# Altium project Luna v2.PrjPcb (part 2 of 7)

## Sheet 05 MIMXRT1170 PART1.SchDoc: Luna v2
size A2; VersionControl_RevNumber: DNP; IsUserConfigurable: DNP; OrgAddr3: Sunrise FL 33323; OrgName: Pixels on Target; Page Create Date: March  8, 1995; Page Number: 5; Page Size: A2; Page Count: 14; OrgAddr2: Suite #104; RevCode: A; Doc: SCH30-00070-00; DsnPath: C:\Users\Carter Nichols\Documents\BitBucket boards (Cadence)\30-00070-00_Original\SCH30-00070-00.DSN; SchematicName: SC30-00070-00; PageName: 05-POWER IN; PageSize: A2; TopSchematic: True; Address4: United States
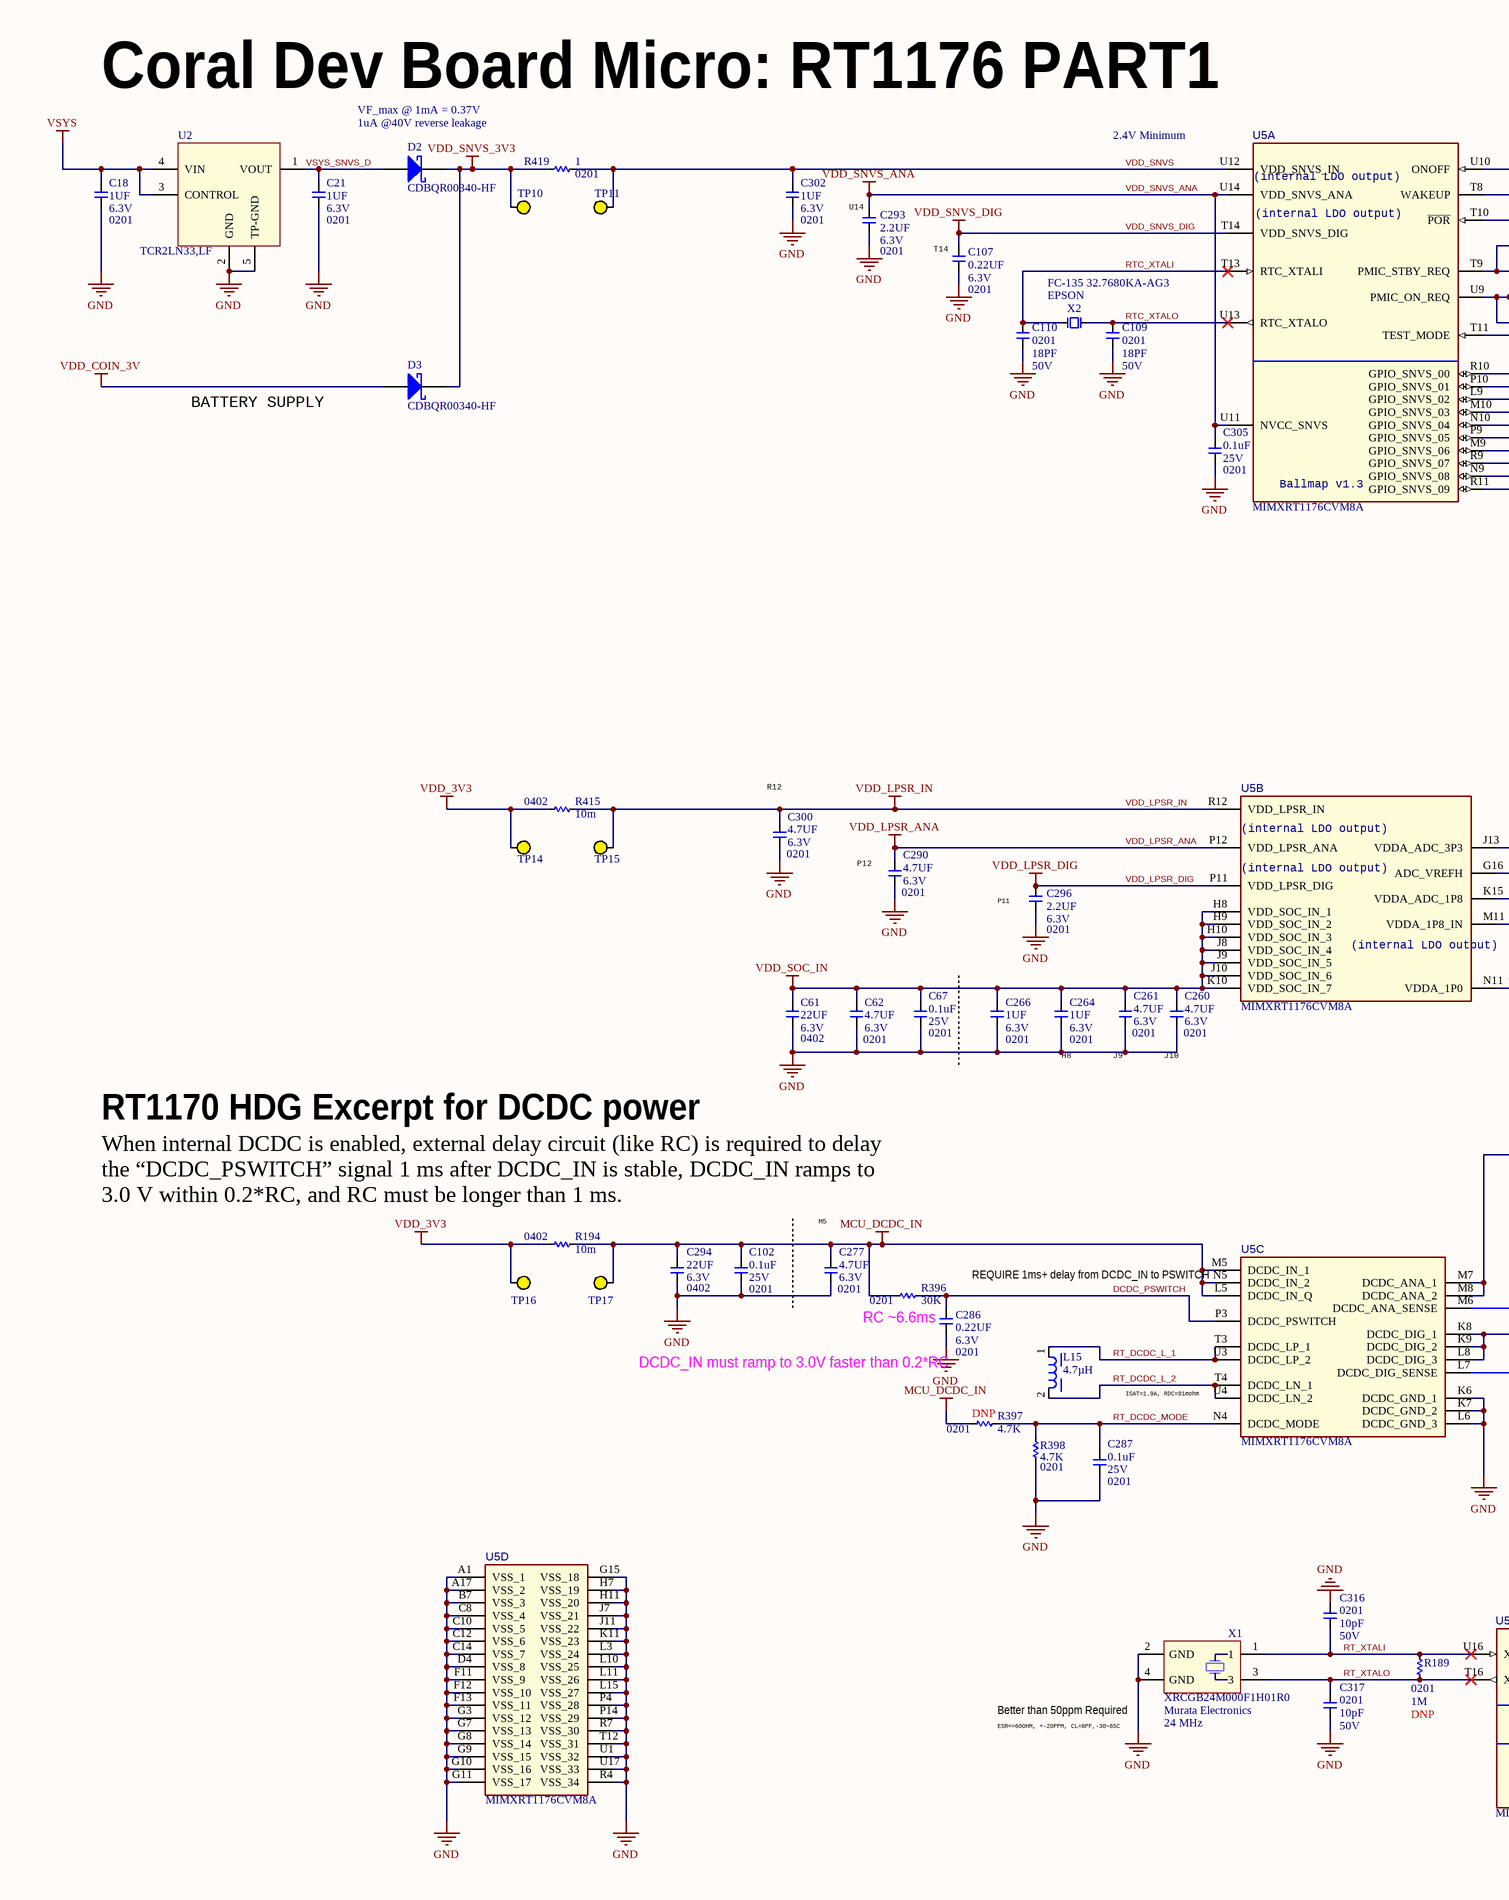
[diagram p7: 05 MIMXRT1170 PART1.SchDoc, left]
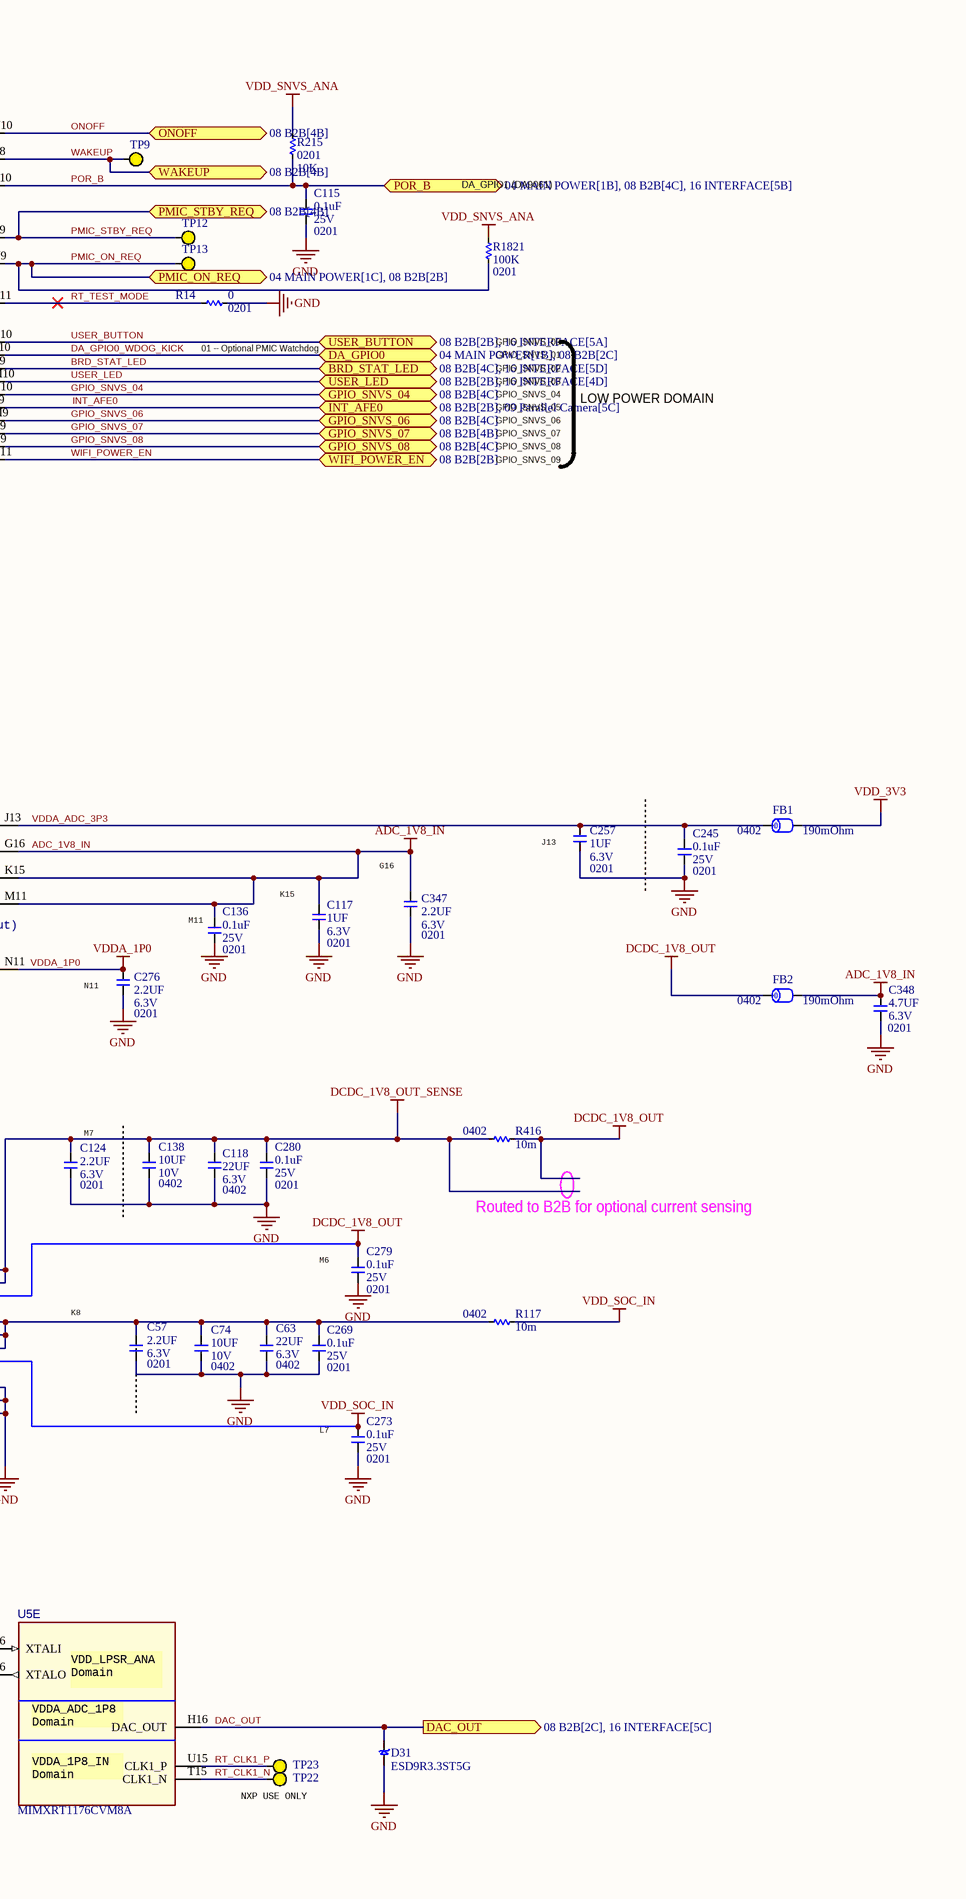
[diagram p8: 05 MIMXRT1170 PART1.SchDoc, right]

### Parts
C18  value 1UF  Package: 0201  Voltage: 6.3V  [C0201_H0.39MM]  (hidden comment: __Template_Cap)
C21  value 1UF  Package: 0201  Voltage: 6.3V  [C0201_H0.39MM]  (hidden comment: __Template_Cap)
C57  value 2.2UF  Package: 0201  Voltage: 6.3V  [C0201_H0.39MM]  (hidden comment: __Template_Cap)
C61  value 22UF  Package: 0402  Voltage: 6.3V  [C0402]  (hidden comment: __Template_Cap)
C62  value 4.7UF  Package: 0201  Voltage: 6.3V  [C0201Y]  (hidden comment: __Template_Cap)
C63  value 22UF  Package: 0402  Voltage: 6.3V  [C0402]  (hidden comment: __Template_Cap)
C67  value 0.1uF  Package: 0201  Voltage: 25V  [C0201Y]  (hidden comment: __Template_Cap)
C74  value 10UF  Package: 0402  Voltage: 10V  [C0402]  (hidden comment: __Template_Cap)
C102  value 0.1uF  Package: 0201  Voltage: 25V  [C0201Y]  (hidden comment: __Template_Cap)
C107  value 0.22UF  Package: 0201  Voltage: 6.3V  [C0201]  (hidden comment: __Template_Cap)
C109  value 18PF  Package: 0201  Voltage: 50V  [C0201Y]  (hidden comment: __Template_Cap)
C110  value 18PF  Package: 0201  Voltage: 50V  [C0201Y]  (hidden comment: __Template_Cap)
C115  value 0.1uF  Package: 0201  Voltage: 25V  [C0201Y]  (hidden comment: __Template_Cap)
C117  value 1UF  Package: 0201  Voltage: 6.3V  [C0201_H0.39MM]  (hidden comment: __Template_Cap)
C118  value 22UF  Package: 0402  Voltage: 6.3V  [C0402]  (hidden comment: __Template_Cap)
C124  value 2.2UF  Package: 0201  Voltage: 6.3V  [C0201_H0.39MM]  (hidden comment: __Template_Cap)
C136  value 0.1uF  Package: 0201  Voltage: 25V  [C0201Y]  (hidden comment: __Template_Cap)
C138  value 10UF  Package: 0402  Voltage: 10V  [C0402]  (hidden comment: __Template_Cap)
C245  value 0.1uF  Package: 0201  Voltage: 25V  [C0201Y]  (hidden comment: __Template_Cap)
C257  value 1UF  Package: 0201  Voltage: 6.3V  [C0201_H0.39MM]  (hidden comment: __Template_Cap)
C260  value 4.7UF  Package: 0201  Voltage: 6.3V  [C0201Y]  (hidden comment: __Template_Cap)
C261  value 4.7UF  Package: 0201  Voltage: 6.3V  [C0201Y]  (hidden comment: __Template_Cap)
C264  value 1UF  Package: 0201  Voltage: 6.3V  [C0201_H0.39MM]  (hidden comment: __Template_Cap)
C266  value 1UF  Package: 0201  Voltage: 6.3V  [C0201_H0.39MM]  (hidden comment: __Template_Cap)
C269  value 0.1uF  Package: 0201  Voltage: 25V  [C0201Y]  (hidden comment: __Template_Cap)
C273  value 0.1uF  Package: 0201  Voltage: 25V  [C0201Y]  (hidden comment: __Template_Cap)
C276  value 2.2UF  Package: 0201  Voltage: 6.3V  [C0201_H0.39MM]  (hidden comment: __Template_Cap)
C277  value 4.7UF  Package: 0201  Voltage: 6.3V  [C0201Y]  (hidden comment: __Template_Cap)
C279  value 0.1uF  Package: 0201  Voltage: 25V  [C0201Y]  (hidden comment: __Template_Cap)
C280  value 0.1uF  Package: 0201  Voltage: 25V  [C0201Y]  (hidden comment: __Template_Cap)
C286  value 0.22UF  Package: 0201  Voltage: 6.3V  [C0201]  (hidden comment: __Template_Cap)
C287  value 0.1uF  Package: 0201  Voltage: 25V  [C0201Y]  (hidden comment: __Template_Cap)
C290  value 4.7UF  Package: 0201  Voltage: 6.3V  [C0201Y]  (hidden comment: __Template_Cap)
C293  value 2.2UF  Package: 0201  Voltage: 6.3V  [C0201_H0.39MM]  (hidden comment: __Template_Cap)
C294  value 22UF  Package: 0402  Voltage: 6.3V  [C0402]  (hidden comment: __Template_Cap)
C296  value 2.2UF  Package: 0201  Voltage: 6.3V  [C0201_H0.39MM]  (hidden comment: __Template_Cap)
C300  value 4.7UF  Package: 0201  Voltage: 6.3V  [C0201Y]  (hidden comment: __Template_Cap)
C302  value 1UF  Package: 0201  Voltage: 6.3V  [C0201_H0.39MM]  (hidden comment: __Template_Cap)
C305  value 0.1uF  Package: 0201  Voltage: 25V  [C0201Y]  (hidden comment: __Template_Cap)
C316  value 10pF  Package: 0201  Voltage: 50V  [C0201Y]  (hidden comment: __Template_Cap)
C317  value 10pF  Package: 0201  Voltage: 50V  [C0201Y]  (hidden comment: __Template_Cap)
C347  value 2.2UF  Package: 0201  Voltage: 6.3V  [C0201_H0.39MM]  (hidden comment: __Template_Cap)
C348  value 4.7UF  Package: 0201  Voltage: 6.3V  [C0201Y]  (hidden comment: __Template_Cap)
D2  value CDBQR00340-HF  [D0402_H0.55MM]  (hidden comment: __Template_DIODE_SCHOTTKY)
D3  value CDBQR00340-HF  [D0402_H0.55MM]  (hidden comment: __Template_DIODE_SCHOTTKY)
D31  value ESD9R3.3ST5G  [SOD1060X40]  (hidden comment: __Template_Diode_TVS_A/K)
FB1  Package: 0402  Rdc max: 190mOhm  [L0402_H0.55MM]  (hidden comment: __Template_Ferrite_Bead)
FB2  Package: 0402  Rdc max: 190mOhm  [L0402_H0.55MM]  (hidden comment: __Template_Ferrite_Bead)
L15  value 4.7µH  [IND_74404041047]  (hidden comment: IND_74404041047)
R14  value 0  Package: 0201  [R0201]
R117  value 10m  Package: 0402  [R0402]
R189  value 1M  Package: 0201  [R0201]
R194  value 10m  Package: 0402  [R0402]
R215  value 10K  Package: 0201  [R0201]
R396  value 30K  Package: 0201  [R0201]
R397  value 4.7K  Package: 0201  [R0201]
R398  value 4.7K  Package: 0201  [R0201]
R415  value 10m  Package: 0402  [R0402]
R416  value 10m  Package: 0402  [R0402]
R419  value 1  Package: 0201  [R0201]
R1821  value 100K  Package: 0201  [R0201]
TP9  TESTPAD_30MIL  [TESTPAD_SMT_30MIL]  (value not drawn)  (no BOM)
TP10  TESTPAD_30MIL  [TESTPAD_SMT_30MIL]  (value not drawn)  (no BOM)
TP11  TESTPAD_30MIL  [TESTPAD_SMT_30MIL]  (value not drawn)  (no BOM)
TP12  TESTPAD_30MIL  [TESTPAD_SMT_30MIL]  (value not drawn)  (no BOM)
TP13  TESTPAD_30MIL  [TESTPAD_SMT_30MIL]  (value not drawn)  (no BOM)
TP14  TESTPAD_30MIL  [TESTPAD_SMT_30MIL]  (value not drawn)  (no BOM)
TP15  TESTPAD_30MIL  [TESTPAD_SMT_30MIL]  (value not drawn)  (no BOM)
TP16  TESTPAD_30MIL  [TESTPAD_SMT_30MIL]  (value not drawn)  (no BOM)
TP17  TESTPAD_30MIL  [TESTPAD_SMT_30MIL]  (value not drawn)  (no BOM)
TP22  TESTPAD_30MIL  [TESTPAD_SMT_30MIL]  (value not drawn)  (no BOM)
TP23  TESTPAD_30MIL  [TESTPAD_SMT_30MIL]  (value not drawn)  (no BOM)
U2  MFG P/N: TCR2LN33,LF  [SDFN80X80X40-5]  (hidden comment: REG_LIN_TCR2LN33)
U5  MFG P/N: MIMXRT1176CVM8A  [BGA289C80P17X17_1400X14000X152]  (hidden comment: MCU_MIMXRT1176CVM8A)  (parts A,B,C,D,E of 12)
X1  Mfg: XRCGB24M000F1H01R0  Mfg P/N: Murata Electronics  Frequency: 24 MHz  [XTAL_MURATA_XRCGB24M000F1H01R0]  (hidden comment: XTAL_MURATA_XRCGB24M000F1H01R0)
X2  Mfg: FC-135 32.7680KA-AG3  Mfg P/N: EPSON  [XTAL_EPSON_ADUCM355BCCZ]  (hidden comment: __template_xtal)

### Ports
BRD_STAT_LED (bidir, see 08 B2B[4C], 16 INTERFACE[5D]), DA_GPIO0 (bidir, see 04 MAIN POWER[1B], 08 B2B[2C]), DAC_OUT (out, see 08 B2B[2C], 16 INTERFACE[5C]), GPIO_SNVS_04 (bidir, see 08 B2B[4C]), GPIO_SNVS_06 (bidir, see 08 B2B[4C]), GPIO_SNVS_07 (bidir, see 08 B2B[4B]), GPIO_SNVS_08 (bidir, see 08 B2B[4C]), INT_AFE0 (bidir, see 08 B2B[2B], 09 Parallel Camera[5C]), ONOFF (bidir, see 08 B2B[4B]), PMIC_ON_REQ (bidir, see 04 MAIN POWER[1C], 08 B2B[2B]), PMIC_STBY_REQ (bidir, see 08 B2B[4B]), POR_B (bidir, see 04 MAIN POWER[1B], 08 B2B[4C], 16 INTERFACE[5B]), USER_BUTTON (bidir, see 08 B2B[2B], 16 INTERFACE[5A]), USER_LED (bidir, see 08 B2B[2B], 16 INTERFACE[4D]), WAKEUP (bidir, see 08 B2B[4B]), WIFI_POWER_EN (bidir, see 08 B2B[2B])

### Nets
ADC_1V8_IN: C117.1 C136.1 C347.1 C348.1 FB2.2 U5.G16(ADC_VREFH) U5.K15(VDDA_ADC_1P8) U5.M11(VDDA_1P8_IN)
DCDC_1V8_OUT: C279.1 FB2.1 R416.2 U5.M6(DCDC_ANA_SENSE)
DCDC_1V8_OUT_SENSE: C118.1 C124.1 C138.1 C280.1 R416.1 U5.M7(DCDC_ANA_1) U5.M8(DCDC_ANA_2)
GND: C18.2 C21.2 C57.2 C61.2 C62.2 C63.2 C67.2 C74.2 C102.2 C107.2 C109.2 C110.2 C115.2 C117.2 C118.2 C124.2 C136.2 C138.2 C245.2 C257.2 C260.2 C261.2 C264.2 C266.2 C269.2 C273.2 C276.2 C277.2 C279.2 C280.2 C286.2 C287.2 C290.2 C293.2 C294.2 C296.2 C300.2 C302.2 C305.2 C316.1 C317.2 C347.2 C348.2 D31.A R14.2 R398.1 U2.2(GND) U2.5(TP-GND) U5.A1(VSS_1) U5.A17(VSS_2) U5.B7(VSS_3) U5.C8(VSS_4) U5.C10(VSS_5) U5.C12(VSS_6) U5.C14(VSS_7) U5.D4(VSS_8) U5.F11(VSS_9) U5.F12(VSS_10) U5.F13(VSS_11) U5.G3(VSS_12) U5.G7(VSS_13) U5.G8(VSS_14) U5.G9(VSS_15) U5.G10(VSS_16) U5.G11(VSS_17) U5.G15(VSS_18) U5.H7(VSS_19) U5.H11(VSS_20) U5.J7(VSS_21) U5.J11(VSS_22) U5.K6(DCDC_GND_1) U5.K7(DCDC_GND_2) U5.K11(VSS_23) U5.L3(VSS_24) U5.L6(DCDC_GND_3) U5.L10(VSS_25) U5.L11(VSS_26) U5.L15(VSS_27) U5.P4(VSS_28) U5.P14(VSS_29) U5.R4(VSS_34) U5.R7(VSS_30) U5.T12(VSS_31) U5.U1(VSS_32) U5.U17(VSS_33) X1.2(GND) X1.4(GND)
MCU_DCDC_IN: C102.1 C277.1 C294.1 R194.2 R396.1 R397.1 TP17.1 U5.L5(DCDC_IN_Q) U5.M5(DCDC_IN_1) U5.N5(DCDC_IN_2)
VDD_3V3: FB1.2 R194.1 R415.1 TP14.1 TP16.1
VDD_COIN_3V: D3.A
VDD_LPSR_ANA: C290.1 U5.P12(VDD_LPSR_ANA)
VDD_LPSR_DIG: C296.1 U5.P11(VDD_LPSR_DIG)
VDD_LPSR_IN: C300.1 R415.2 TP15.1 U5.R12(VDD_LPSR_IN)
VDD_SNVS_3V3: D2.K D3.K R419.1 TP10.1
VDD_SNVS_ANA: C293.1 C305.1 R215.2 R1821.2 U5.U11(NVCC_SNVS) U5.U14(VDD_SNVS_ANA)
VDD_SNVS_DIG: C107.1 U5.T14(VDD_SNVS_DIG)
VDD_SOC_IN: C61.1 C62.1 C67.1 C260.1 C261.1 C264.1 C266.1 C273.1 R117.2 U5.H8(VDD_SOC_IN_1) U5.H9(VDD_SOC_IN_2) U5.H10(VDD_SOC_IN_3) U5.J8(VDD_SOC_IN_4) U5.J9(VDD_SOC_IN_5) U5.J10(VDD_SOC_IN_6) U5.K10(VDD_SOC_IN_7) U5.L7(DCDC_DIG_SENSE)
VDDA_1P0: C276.1 U5.N11(VDDA_1P0)
VSYS: C18.1 U2.3(CONTROL) U2.4(VIN)
BRD_STAT_LED: U5.L9(GPIO_SNVS_02) ; port BRD_STAT_LED
DA_GPIO0_WDOG_KICK: U5.P10(GPIO_SNVS_01) ; port DA_GPIO0
DAC_OUT: D31.K U5.H16(DAC_OUT) ; port DAC_OUT
DCDC_PSWITCH: C286.1 R396.2 U5.P3(DCDC_PSWITCH)
GPIO_SNVS_04: U5.N10(GPIO_SNVS_04) ; port GPIO_SNVS_04
GPIO_SNVS_06: U5.M9(GPIO_SNVS_06) ; port GPIO_SNVS_06
GPIO_SNVS_07: U5.R9(GPIO_SNVS_07) ; port GPIO_SNVS_07
GPIO_SNVS_08: U5.N9(GPIO_SNVS_08) ; port GPIO_SNVS_08
INT_AFE0: U5.P9(GPIO_SNVS_05) ; port INT_AFE0
ONOFF: U5.U10(ONOFF) ; port ONOFF
PMIC_ON_REQ: R1821.1 TP13.1 U5.U9(PMIC_ON_REQ) ; port PMIC_ON_REQ
PMIC_STBY_REQ: TP12.1 U5.T9(PMIC_STBY_REQ) ; port PMIC_STBY_REQ
POR_B: C115.1 R215.1 U5.T10(~{POR}) ; port POR_B
RT_CLK1_N: TP22.1 U5.T15(CLK1_N)
RT_CLK1_P: TP23.1 U5.U15(CLK1_P)
RT_DCDC_L_1: L15.1 U5.T3(DCDC_LP_1) U5.U3(DCDC_LP_2)
RT_DCDC_L_2: L15.2 U5.T4(DCDC_LN_1) U5.U4(DCDC_LN_2)
RT_DCDC_MODE: C287.1 R397.2 R398.2 U5.N4(DCDC_MODE)
RT_TEST_MODE: R14.1 U5.T11(TEST_MODE)
RT_XTALI: C316.2 R189.2 U5.U16(XTALI) X1.1
RT_XTALO: C317.1 R189.1 U5.T16(XTALO) X1.3
RTC_XTALI: C110.1 U5.T13(RTC_XTALI) X2.1
RTC_XTALO: C109.1 U5.U13(RTC_XTALO) X2.2
USER_BUTTON: U5.R10(GPIO_SNVS_00) ; port USER_BUTTON
USER_LED: U5.M10(GPIO_SNVS_03) ; port USER_LED
VDD_SNVS: C302.1 R419.2 TP11.1 U5.U12(VDD_SNVS_IN)
VDDA_ADC_3P3: C245.1 C257.1 FB1.1 U5.J13(VDDA_ADC_3P3)
VSYS_SNVS_D: C21.1 D2.A U2.1(VOUT)
WAKEUP: TP9.1 U5.T8(WAKEUP) ; port WAKEUP
WIFI_POWER_EN: U5.R11(GPIO_SNVS_09) ; port WIFI_POWER_EN
NetC57_1: C57.1 C63.1 C74.1 C269.1 R117.1 U5.K8(DCDC_DIG_1) U5.K9(DCDC_DIG_2) U5.L8(DCDC_DIG_3)

### Notes on the sheet
- Coral Dev Board Micro: RT1176 PART1
- VF_max @ 1mA = 0.37V
- (near D2) 1uA @40V reverse leakage
- 2.4V Minimum
- (near C293) U14
- DA_GPIO1 (DA9061)
- (near C107) T14
- BATTERY SUPPLY
- (near R14) 01 -- Optional PMIC Watchdog
- GPIO_SNVS_00
- GPIO_SNVS_01
- GPIO_SNVS_02
- GPIO_SNVS_03
- GPIO_SNVS_04
- GPIO_SNVS_05
- LOW POWER DOMAIN
- GPIO_SNVS_06
- GPIO_SNVS_07
- GPIO_SNVS_08
- GPIO_SNVS_09
- (near C300) R12
- (near C290) P12
- (near C257) J13
- (near C296) P11
- (near C136) M11
- (near C117) K15
- (near C347) G16
- (near C276) N11
- (near C264) H8
- (near C261) J9
- J10
- RT1170 HDG Excerpt for DCDC power
- (near C124) M7
- (near R194) When internal DCDC is enabled, external delay circuit (like RC) is required to delay the “DCDC_PSWITCH” signal 1 ms after DCDC_IN is stable, DCDC_IN ramps to 3.0 V within 0.2*RC, and RC must be longer than 1 ms.
- (near C277) M5
- Routed to B2B for optional current sensing
- RC ~6.6ms
- REQUIRE 1ms+ delay from DCDC_IN to PSWITCH
- K8
- (near C279) M6
- (near C286) DCDC_IN must ramp to 3.0V faster than 0.2*RC
- ISAT=1.9A, RDC=91mohm
- (near C273) L7
- (near X1) Better than 50ppm Required
- ESR<=60OHM, +-20PPM, CL=8PF,-30~85C
- (near TP22) NXP USE ONLY
- Title
- Size:
- Date:
- File:
- A2
- Number:
- Time:
- Revision:
- Sheet
- of
- (in symbol 117, part A) (internal LDO output); Ballmap v1.3
- (in symbol 117, part B) (internal LDO output)
- (in symbol 117, part E) VDD_LPSR_ANA / Domain; VDDA_ADC_1P8 / Domain; VDDA_1P8_IN / Domain

### Library data of the parts
C18 C21 C117 C257 C264 C266 C302 = 1771: as C12 on sheet 04 MAIN POWER; Status: In Development; Dielectric: X6S; Tolerance: 20%; Height: 0.39mm; Supplier 1: Digi-Key; HelpURL: https://www.digikey.com/product-detail/en/murata-electronics-north-america/GRM033C80J105ME05D/490-13218-1-ND/5877426; ComponentLink1Description: Datasheet; ComponentLink1URL: https://psearch.en.murata.com/capacitor/product/GRM033C80J105ME05%23.pdf; Supplier Part Number 1: 490-13218-1-ND
C57 C124 C276 C293 C296 C347 = 1761: as C1 on sheet 04 MAIN POWER; Status: In Development; Dielectric: X5R; Tolerance: 20%; Height: 0.39mm; Supplier 1: Digi-Key; HelpURL: https://www.digikey.com/product-detail/en/yageo/CC0201MRX5R5BB225/311-3473-1-ND/7164494; ComponentLink1Description: Datasheet; ComponentLink1URL: http://www.yageo.com/documents/recent/UPY-GPHC_X5R_4V-to-50V_25.pdf; Supplier Part Number 1: 311-3473-1-ND
C61 C63 C118 C294 = 1719: as C10 on sheet 04 MAIN POWER; Status: Released; Dielectric: X5R; Tolerance: 20%; Height: 0.70mm; Supplier 1: Digi-Key; HelpURL: https://www.digikey.in/product-detail/en/avx-corporation/04026D226MAT2A/478-9839-1-ND/5964924; ComponentLink1Description: Datasheet; ComponentLink1URL: http://datasheets.avx.com/cx5r.pdf; COMMON: 150-00420-00; LOON: 150-00420-00; Gecko: 150-00420-00; Supplier Part Number 1: 478-9839-1-ND
C62 C260 C261 C277 C290 C300 C348 = 1199: CAP, CER, X5R, 4.7uF, 20%, 6.3V, 0201; ID: 1199; MFG: MURATA; MFG P/N: GRM035R60J475ME15D; XPN: 150-01224-00; PROXY: 150-03477-00; Status: Released; Dielectric: X5R; Tolerance: 20%; Height: 0.33mm T; ComponentLink1Description: Datasheet; COMMON: 150-01224-00; LOON: 150-01224-00; Gecko: 150-01224-00
C67 C102 C115 C136 C245 C269 C273 C279 C280 C287 C305 = 386: as C23 on sheet 04 MAIN POWER; Status: Released; Dielectric: X5R; Tolerance: 20%; Height: 0.33mm T; ComponentLink1Description: Datasheet; COMMON: 150-01204-00; LOON: 150-01204-00; Gecko: 150-01204-00
C74 C138 = 215: CAP, CER, X5R, 10uF, 10V, 20%, 0402, 0.7mm T; ID: 215; MFG: SAMSUNG; MFG P/N: CL05A106MP5NUNC; XPN: 150-00376-00; PROXY: Use ID #1342; EES: 150-04565-00; Status: Released; Dielectric: X5R; Tolerance: 20%; Height: 0.7mm T; ComponentLink1Description: Datasheet; COMMON: 150-00376-00; LOON: 150-00376-00; Gecko: 150-00376-00
C107 C286 = 983: as C16 on sheet 04 MAIN POWER; Status: NRND; Dielectric: X5R; Tolerance: 10%; Height: 0.33mm T; ComponentLink1Description: Datasheet; COMMON: 150-00425-00
C109 C110 = 461: CAP, CER, C0G, 18pF, 50V, 2%, 0201, 0.33mm T; ID: 461; MFG: MURATA; MFG P/N: GRM0335C1H180GA01D; Dielectric: NP0; XPN: XS-10001161; COMMON: 150-01391-00; Status: Released; Tolerance: 2%; Height: 0.33mm T; ComponentLink1Description: Datasheet; LOON: 150-01391-00; Gecko: 150-01391-00
C316 C317 = 49: CAP, CER, NP0, 10pf, 50V, 5%, 0201, 0.33mm T; ID: 49; MFG: MURATA; MFG P/N: GRM0335C1H100JA01J; XPN: 150-00985-00; Status: Released; Dielectric: NP0; Tolerance: 5%; Height: 0.33mm T; ComponentLink1Description: Datasheet; COMMON: 150-00985-00
D2 D3 = 353: DIODE, SCHOTTKY, 40V VRRM, 30mA IO, 500mA SURGE, 0402; ID: 353; MFG: Comchip Technology; Voltage – Forward (VF) (MAX) @ IF: 370 mV @ 1 mA; Current - Reverse Leakage @ VR: 1 µA @ 40 V; Status: Released; MFG P/N: CDBQR00340-HF; Package: 0402; Category: DIODE; RoHS Compliant: Yes; Diode Type: Schottky; Mounting Type: SMD; Voltage - DC Reverse (VR) (MAX): 40V; Current - Average Rectified (IO): 30mA; Operating Temperature – Junction: 125°C (Max); Supplier 1: Digi-Key; HelpURL: https://www.digikey.com/en/products/detail/comchip-technology/CDBQR00340-HF/3308478?s=N4IgTCBcDaIMIBEBCBFASgBgwZgCwYFoAJAMRAF0BfIA; ComponentLink1Description: Datasheet; ComponentLink1URL: https://www.comchiptech.com/admin/files/product/QW-G1106%20CDBQR00340-HF%20RevB.pdf; Height: 0.55mm; Supplier Part Number 1: 641-1978-2-ND
D31 = 192: TVS, DIODE, UNIDIR, 3.3VRWM, 4.8VBR, 7.8VCL, SOD-923; ID: 192; MFG: ON Semiconductor; Diode Type: Zener; PROXY: 480-01364-00; LOON: 430-00045-00; Voltage - Clamping (Max) @ Ipp: 7.8V; Status: Released; MFG P/N: ESD9R3.3ST5G; Package: SOD-923; Category: Diode; RoHS Compliant: Yes; Mounting Type: SMD; Operating Temperature – Junction: -55°C ~ 125°C (TJ); Supplier 1: Digi-Key; HelpURL: https://www.digikey.in/product-detail/en/on-semiconductor/ESD9R3.3ST5G/ESD9R3.3ST5GOSCT-ND/2704997; ComponentLink1Description: Datasheet; ComponentLink1URL: http://www.onsemi.com/pub/Collateral/ESD9R3.3S-D.PDF; Height: 0.4mm; Supplier Part Number 1: ESD9R3.3ST5GOSCT-ND
FB1 FB2 = 913: as FB?#1 on sheet Analog Sense; ComponentLink1Description: Datasheet; Status: Released; Idc max: 550mA; Supplier 1: Digi-Key; HelpURL: https://www.digikey.com/product-detail/en/murata-electronics/BLM15AG121SN1D/490-1005-1-ND/584453; ComponentLink1URL: https://www.murata.com/en-us/products/productdata/8796740059166/ENFA0018.pdf; Height: 0.55mm; Supplier Part Number 1: 490-1005-1-ND
L15 = 946: IND, WIREWOUND, SEMI-SHIELDED, 4.7uH, 1.55A, 20%, DCR 0.091, SMD; ID: 946; Catagory: Fixed Inductors; MFG: Würth Elektronik; ComponentLink1Description: Datasheet; Status: Released; MFG P/N: 74404041047; Package: SMD; Tolerance: 20%; Idc max: 1.55A; Supplier 1: Digi-Key; HelpURL: https://www.digikey.com/en/products/detail/w%C3%BCrth-elektronik/74404041047/5353045?s=N4IgTCBcDaIOwBYEAYUIIyriAugXyA; ComponentLink1URL: https://www.we-online.de/katalog/datasheet/74404041047.pdf; Height: 1.20mm; Supplier Part Number 1: 732-7226-2-ND
R14 = 8315: RES, 0.0, 1/20W, 0201; ID: 8315; MFG: PANASONIC; MFG P/N: ERJ1GN0R00C; Tolerance: JUMPER; COMMON: 470-00013-00; PROXY: Use ID #6940; Status: Released; Power: 1/20W; LOON: 470-00013-00; Gecko: 470-00013-00; XPN: 470-00013-00
R117 R194 R415 R416 = 7159: RES, 0.01, 5%, 1/4W, 0402; ID: 7159; MFG: YAGEO; MFG P/N: PE0402JRF470R01L; COMMON: 470-02385-00; Status: Released; Power: 1/4W; Tolerance: 5%; LOON: 470-02385-00; Gecko: 470-02385-00; XPN: 470-02385-00
R189 = 7806: as R9 on sheet 04 MAIN POWER; Status: NRND; Power: 1/20W; Tolerance: 1%; LOON: 470-00029-00; Gecko: 470-00029-00; XPN: 470-00029-00; DNP: DNP
R215 = 4151: as R4 on sheet 04 MAIN POWER; Status: Released; Power: 1/20W; Tolerance: 1%; Height: 0.26mm; Supplier 1: Digi-Key; LOON: 470-00033-00; Gecko: 470-00033-00; XPN: 470-00033-00; Supplier Part Number 1: 311-10.0KMCT-ND
R396 = 8000: RES, 30K, 5%, 1/20W, 0201; ID: 8000; MFG: PANASONIC; MFG P/N: ERJ1GEJ303C; COMMON: 470-00496-00; Status: NRND; Power: 1/20W; Tolerance: 5%; LOON: 470-00496-00; Gecko: 470-00496-00; XPN: 470-00496-00
R397 R398 = 6602: RES, 4.7K, 5%, 1/20W, 0201; ID: 6602; MFG: YAGEO; MFG P/N: RC0201JR-074K7L; COMMON: 470-00012-00; Status: Released; Power: 1/20W; Tolerance: 5%; LOON: 470-00012-00; Gecko: 470-00012-00; XPN: 470-00012-00
  R397: DNP: DNP
R419 = 6471: RES, 1.0, 1%, 1/20W, 0201; ID: 6471; MFG: STACKPOLE ELECTRONICS; MFG P/N: RMCF0201FT1R00; COMMON: 470-00541-00; XPN: XS-10012522; Status: Released; Power: 1/20W; Tolerance: 1%
R1821 = 7818: as R7 on sheet 04 MAIN POWER; Status: NRND; Power: 1/20W; Tolerance: 1%; LOON: 470-00506-00; Gecko: 470-00506-00; XPN: 470-00506-00
TP9-TP17 TP22 TP23 = 178: as TP1 on sheet 04 MAIN POWER; Status: Released; ComponentLink1URL: _PCB Feature
U2 = 868: IC, REG, TCR2LN33, LINEAR, LDO, 5.5V VIN, 3.3V VOUT, CMOS O/P, SDFN-4; ID: 868; MFG: Toshiba Semiconductor and Storage; Status: Released; Package: 4-SDFN (0.8x0.8); Category: Integrated Circuits (ICs); RoHS Compliant: Yes; Supplier 1: Digi-Key; HelpURL: https://www.digikey.com/en/products/detail/toshiba-semiconductor-and-storage/TCR2LN33-LF/5210658?s=N4IgTCBcDaICoGEBKYAyA5AzJgNKgYiALoC%2BQA; ComponentLink1Description: Datasheet; ComponentLink1URL: https://toshiba.semicon-storage.com/ap-en/semiconductor/product/power-management-ics/low-dropout-regulators-ldo-regulators/detail.TCR2LN33.html; Mounting Type: SMD; Height: 0.4mm; Supplier Part Number 1: TCR2LN33LFTR-ND
U5 = 117: IC, PROCESSOR, MIMXRT1176CV, ARM CORTEX-M4/M7, 2MB RAM, SDRAM, WLAN, BGA-289; ID: 117; MFG: NXP Semiconductors; Status: Released; Package: BGA-289; Category: Integrated Circuits (ICs); RoHS Compliant: Yes; ComponentLink1Description: Datasheet; ComponentLink1URL: https://drive.google.com/file/d/1FTzS3WjHycHWpbzAg-R_xAViv5bKJdqv/view; Height: 1.52mm
X1 = 140: XTAL, 24MHz, +/-10PPM STAB, +/-10PPM, 8pF, 80 OHM, SMD-4; ID: 140; ESR: 80 Ohms; Frequency Stability: ±10ppm; Status: Released; Package: 4-SMD, No Lead; Category: Crystals, Oscillators, Resonators / Crystals; RoHS Compliant: Yes; Mounting Type: SMD; Supplier 1: Digi-Key; Frequency Tolerance: ±10ppm; Height: 0.7mm; Load Capacitance: 8pF; Operating Temperature: -20°C ~ 70°C; Type: MHz Crystal; HelpURL: https://www.digikey.com/en/products/detail/murata-electronics/XRCGB24M000F1H01R0/9959645?s=N4IgTCBcDaIBoCUDCBxAQmALAWQAz4DEBGACVyIVxAF0BfIA; ComponentLink1Description: Datasheet; ComponentLink1URL: https://www.murata.com/products/productdata/8801057439774/SPEC-XRCGB24M000F1H01R0.pdf; Supplier Part Number 1: 490-18288-2-ND
X2 = 139: XTAL, 32.7680KHz, +/-20PPM, 7pF, 70 KOHM, SMD-2 / XTAL, 32.7680KHz, +/-20PPM, 7pF, 70 KOHM, SMD-2"; ID: 139; ESR: 70 kOhms; Frequency: 32.768 kHz; Frequency Tolerance: ±20ppm; Status: Released; Package: 2-SMD, No Lead; Category: Crystals, Oscillators, Resonators / Crystals; RoHS Compliant: Yes; Mounting Type: SMD; Supplier 1: Digi-Key; Height: 0.9mm; Load Capacitance: 7pF; Operating Temperature: -40°C ~ 85°C; Type: kHz Crystal (Tuning Fork); HelpURL: https://www.digikey.com/en/products/detail/epson/FC-135-32-7680KA-AG3/5259897; ComponentLink1Description: Datasheet; ComponentLink1URL: https://support.epson.biz/td/api/doc_check.php?dl=brief_FC-135&lang=en; Supplier Part Number 1: SER4086TR-ND